# EAGLE board star (EAGLE 9.6.2)
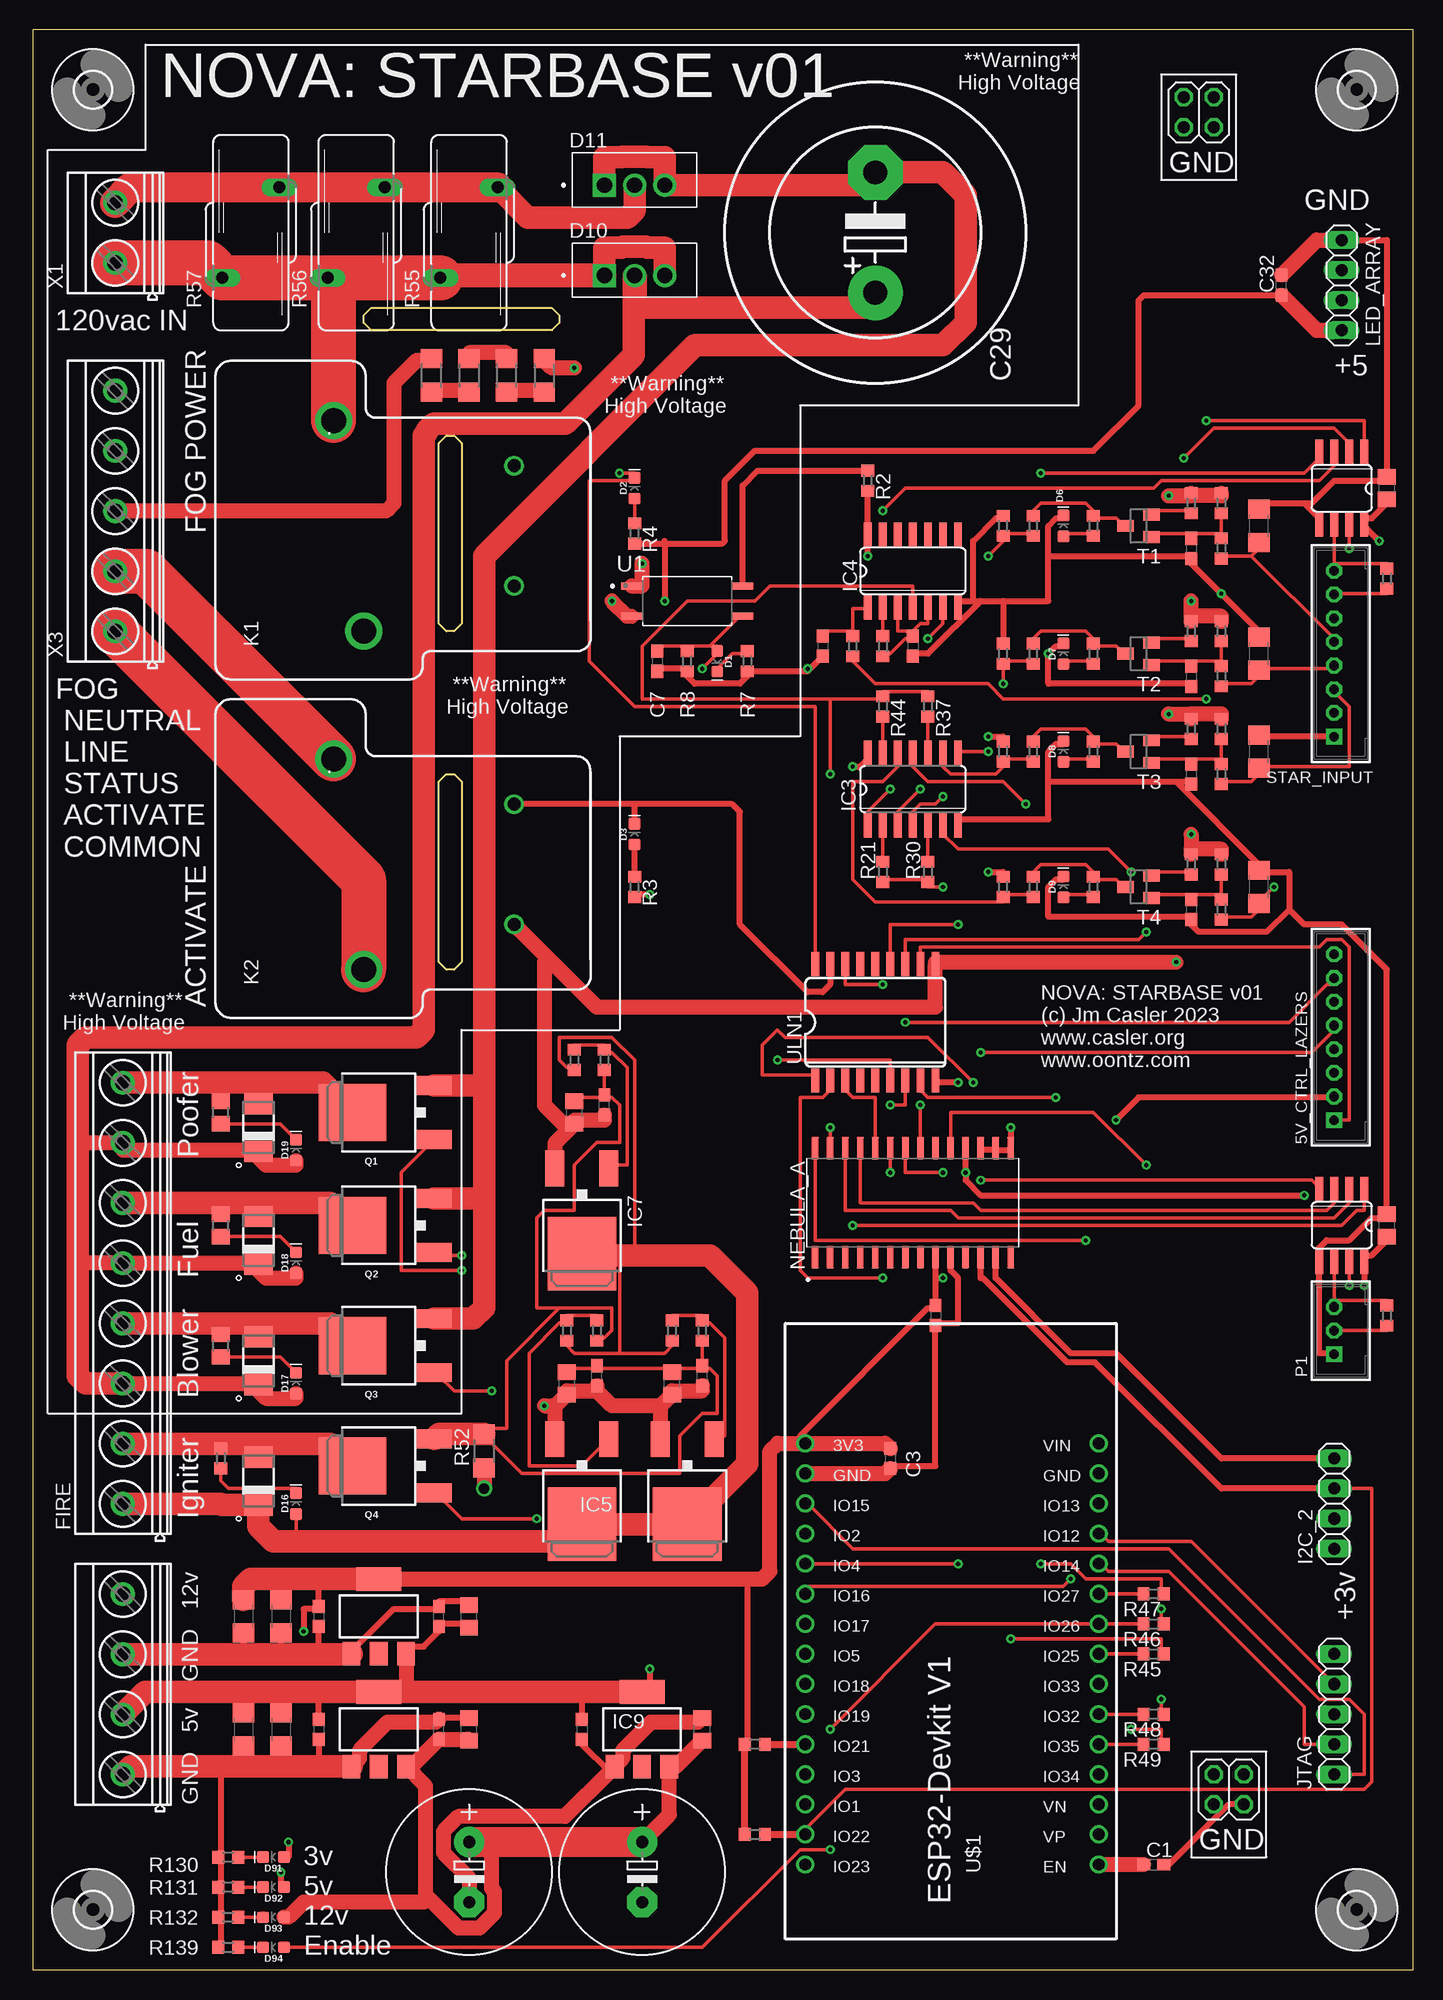
[diagram p2: board, top side]
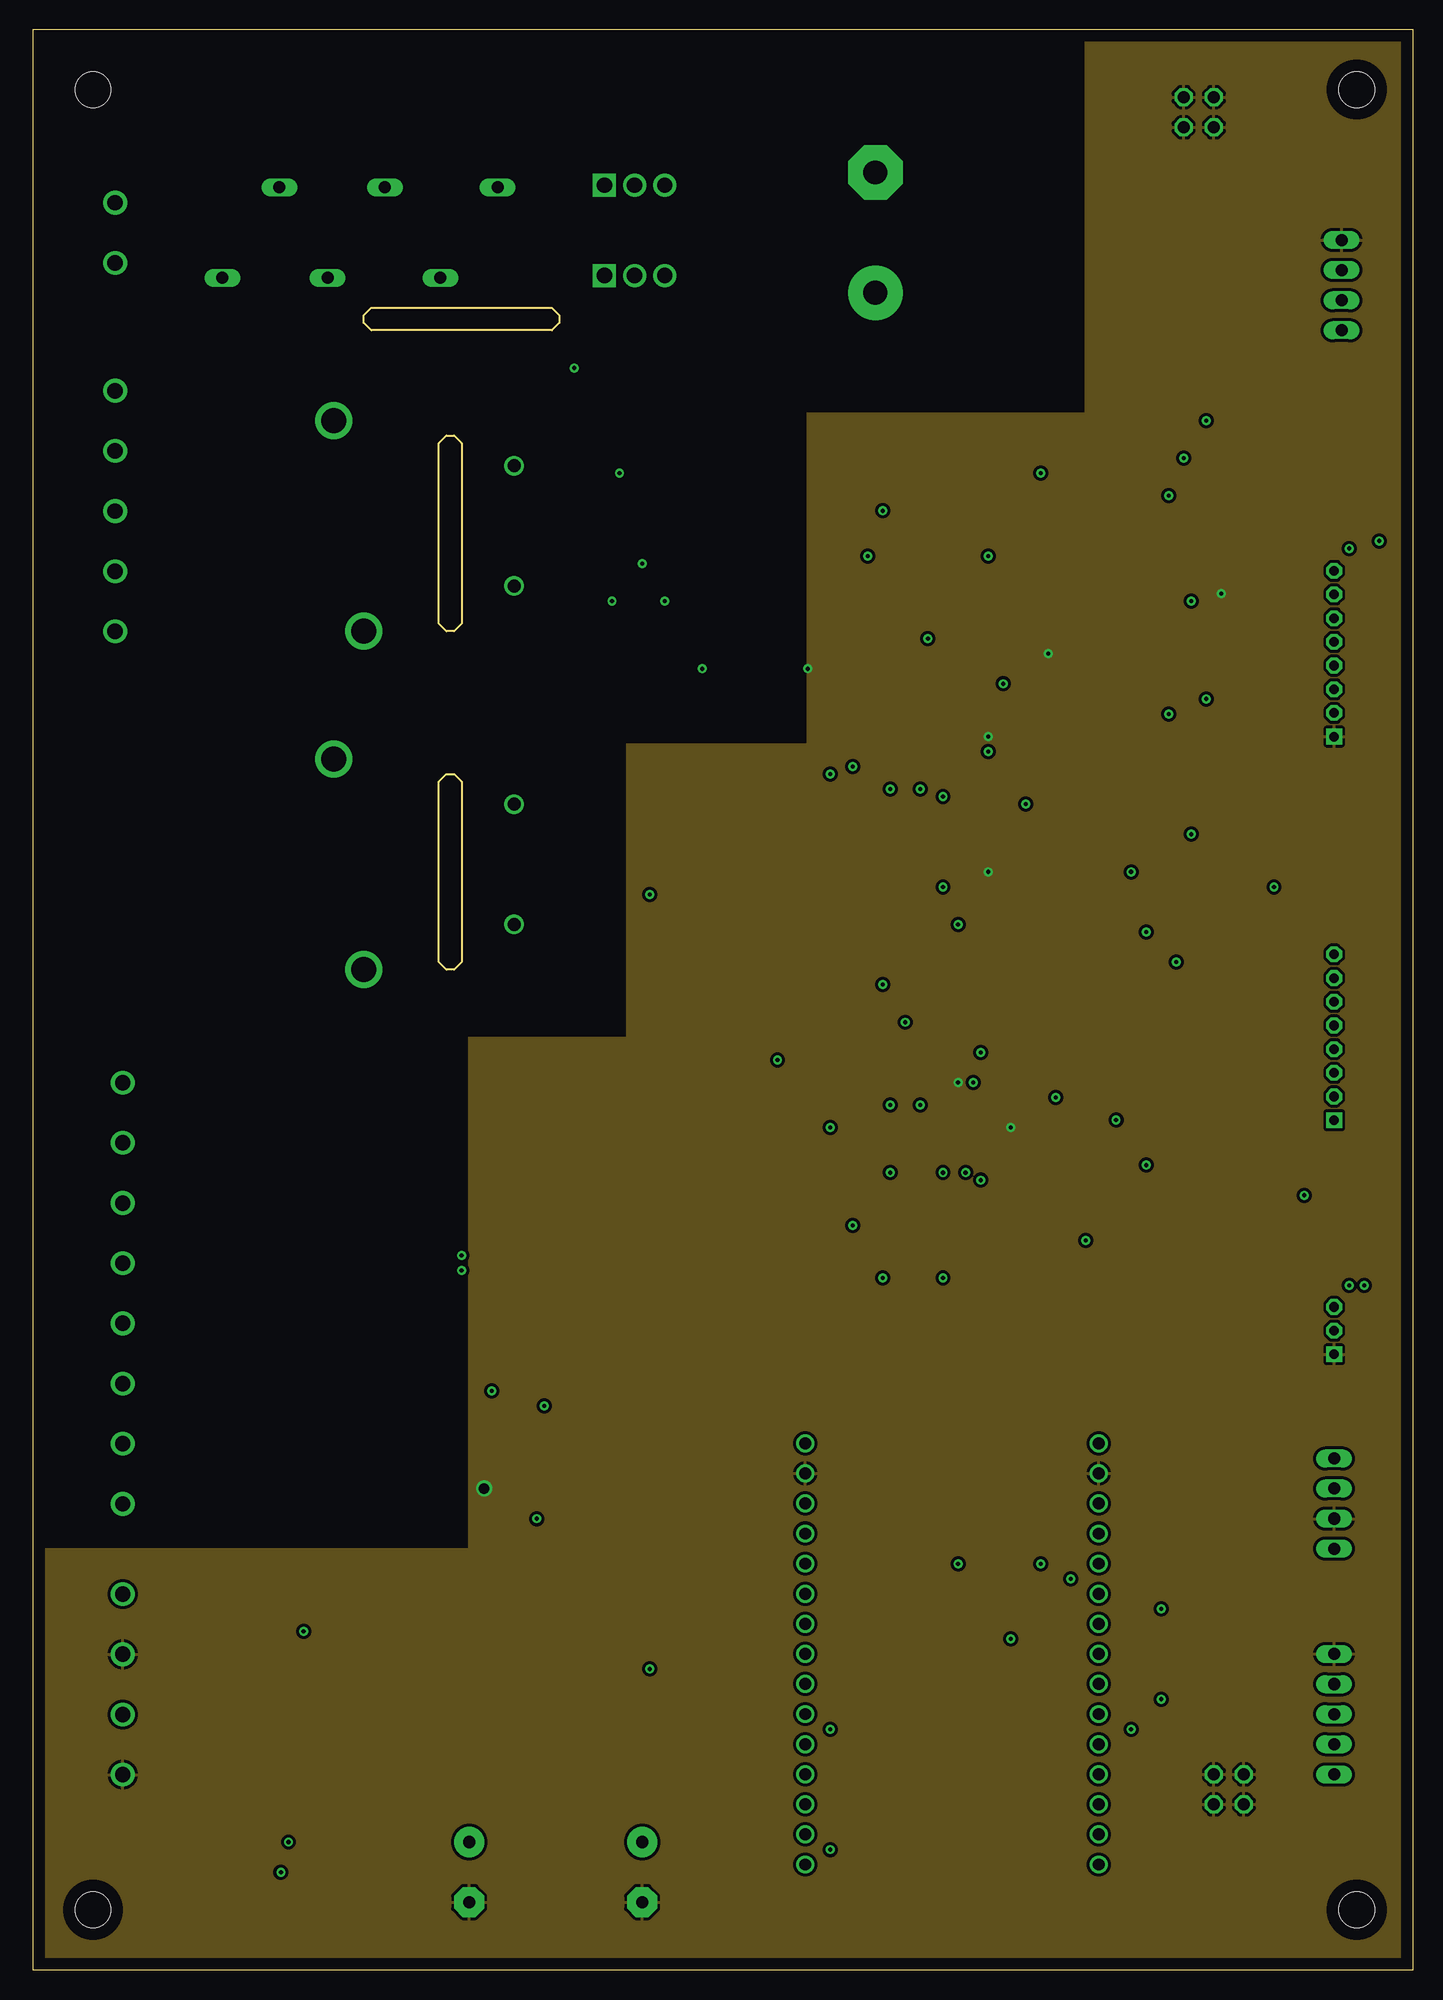
[diagram p3: board, inner layer $GND]
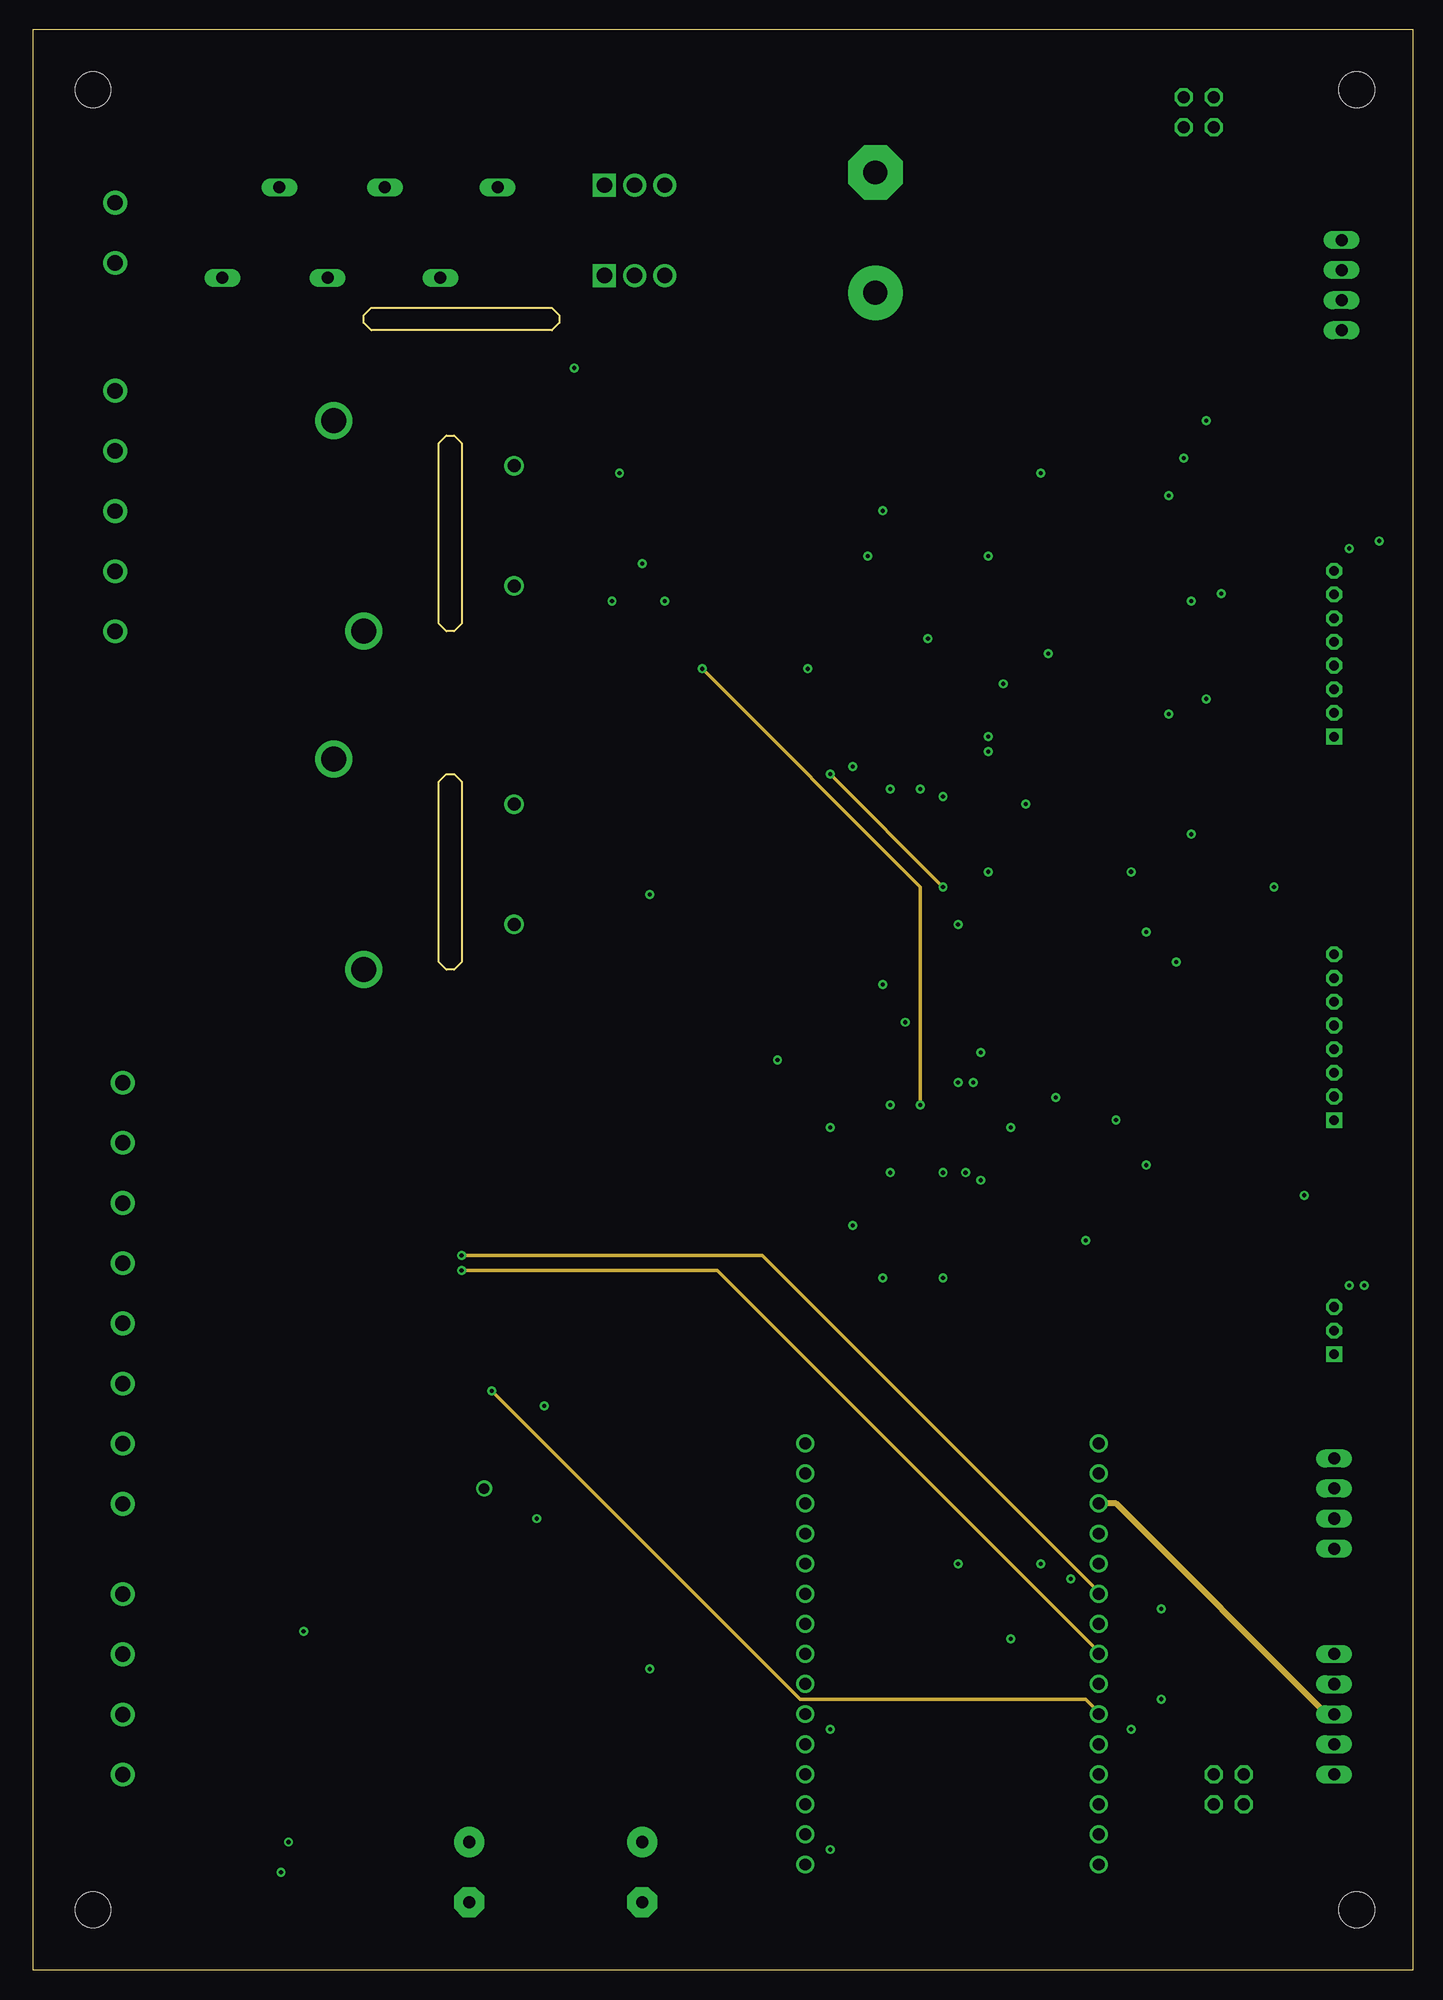
[diagram p4: board, inner layer SIGNAL3]
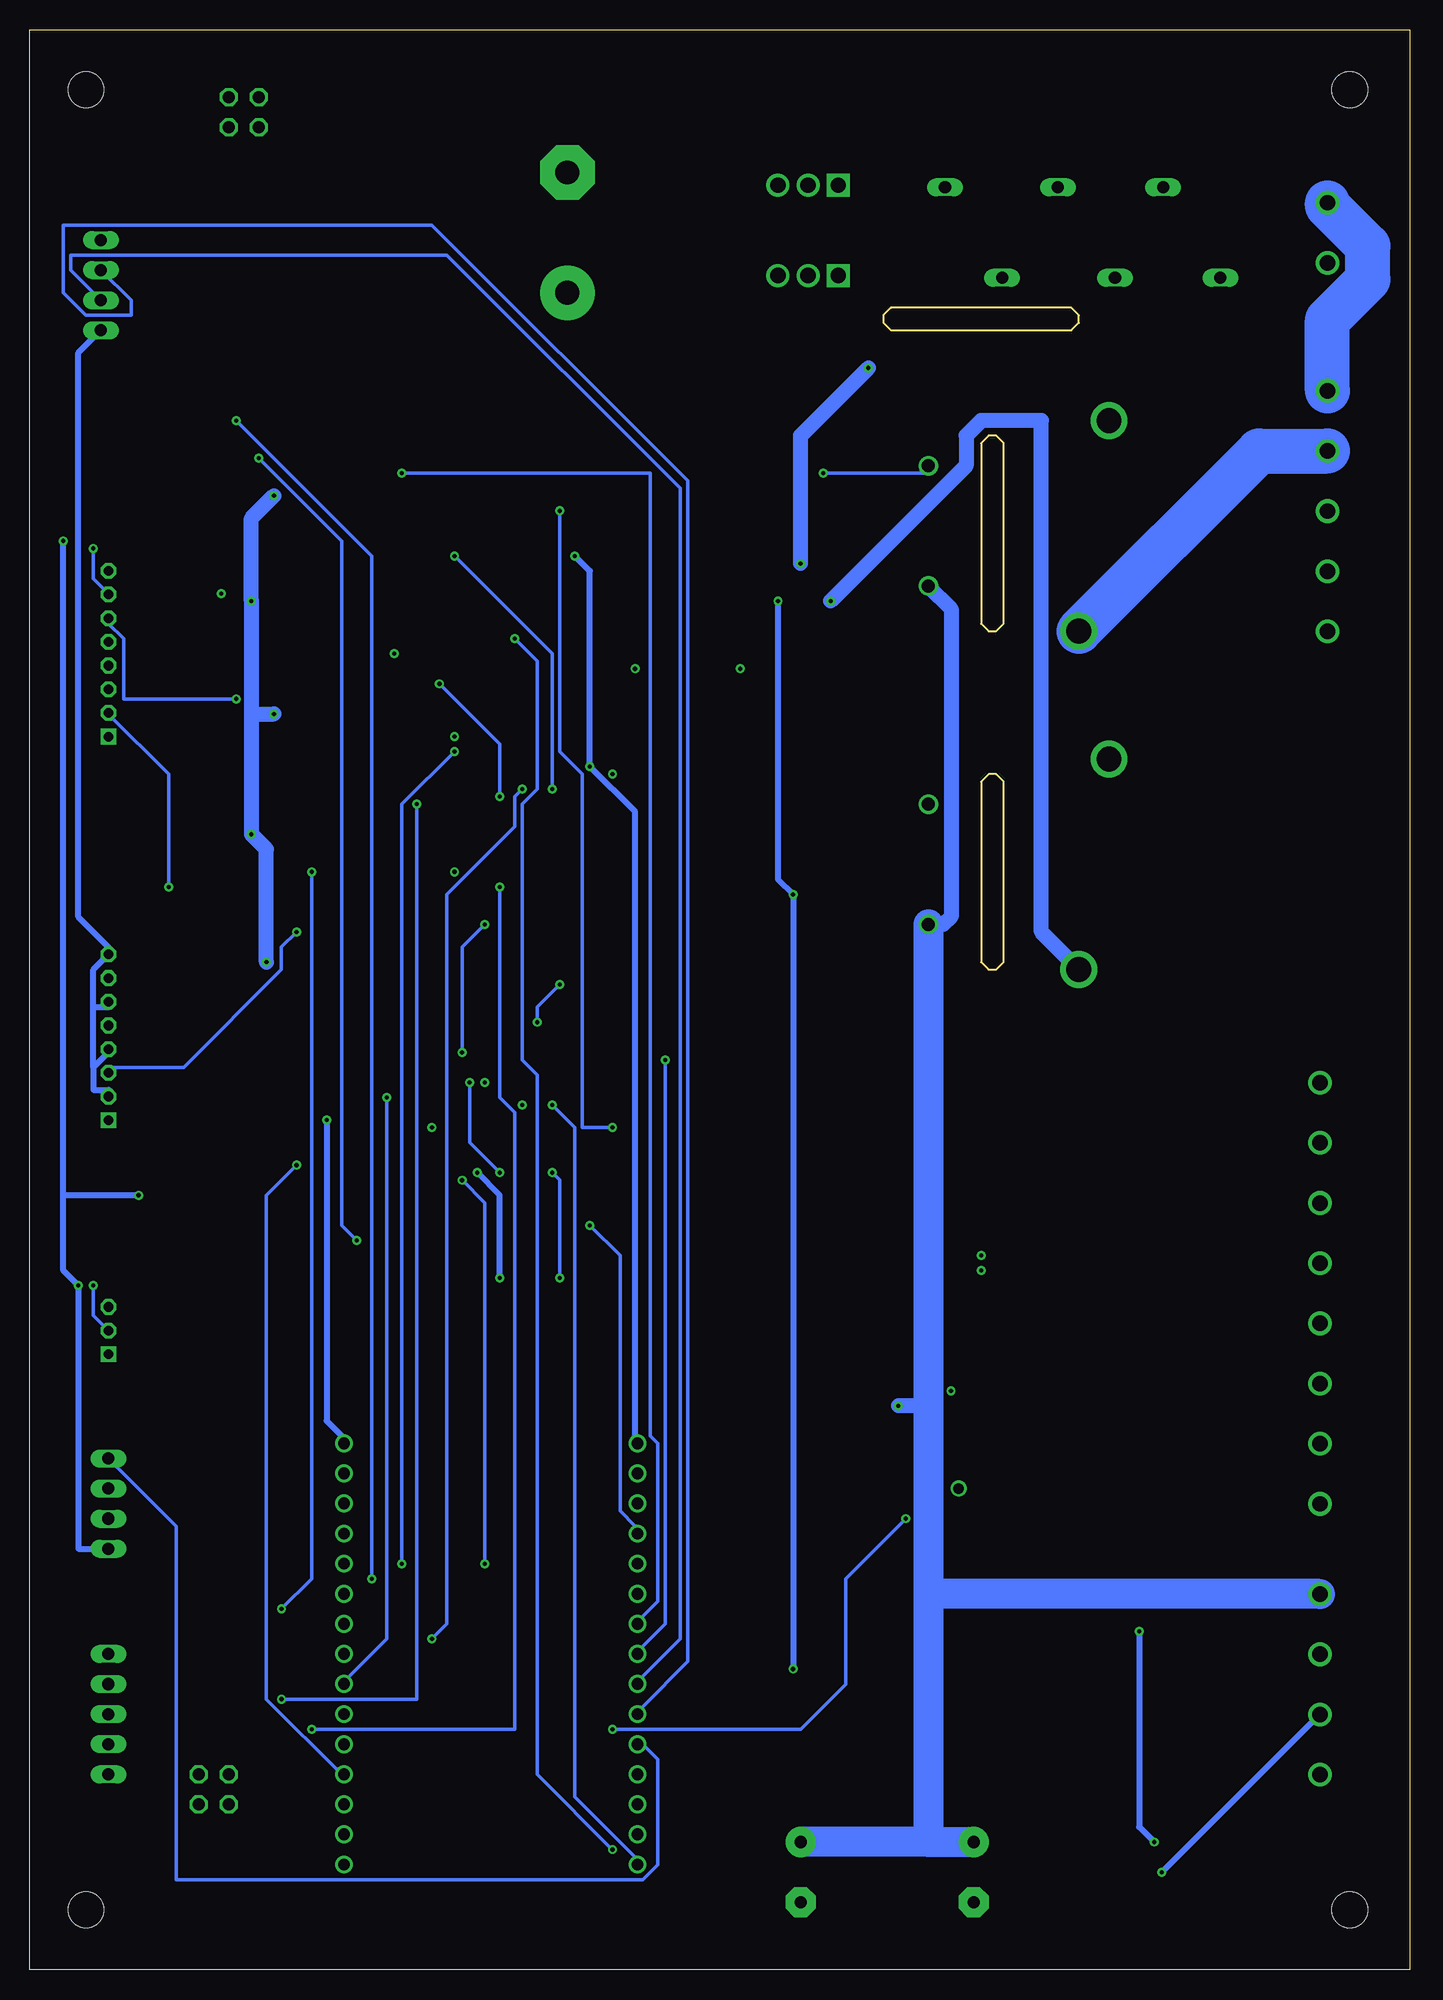
[diagram p5: board, bottom side, seen from below]

Size 116.51 x 163.82 mm. Coordinates in mm from the lower left corner, seen from the top.
Outline: 0,0 116.51,0 116.51,163.82 0,163.82 0,0
Copper layers (1+2*15+16): Top 0.035mm / dielectric 1.5mm / $GND 0.035mm / dielectric 0.15mm / SIGNAL3 0.035mm / dielectric 0.2mm / Bottom 0.035mm
Design rules "default *": minimum track width 6mil, minimum drill 0.35mm, track to track 6mil, track to pad 6mil, pad to pad 6mil, via to via 6mil, smd to smd 6mil, copper to edge 40mil, drill to drill 6mil, minimum pad ring 10mil, minimum via ring 8mil, stop-mask expansion 4mil, vias tented up to drill 20mil, thermal gap 10mil
Net classes: 0 default: width 0.305 mm, clearance 0.254 mm; 1 GND: width 0.508 mm, clearance 0.254 mm; 2 12V: width 1.27 mm, clearance 0.254 mm; 3 5V: width 0.508 mm, clearance 0.254 mm; 4 3V3: width 0.508 mm, clearance 0.254 mm; 5 12V_FUSED: width 0.635 mm, clearance 0.254 mm; 6 120VAC_PWR: width 1.27 mm, clearance 0.508 mm; 7 120VAC: width 1.27 mm, clearance 0.508 mm; 8 60V: width 1.27 mm, clearance 0.508 mm
tRestrict: area 34.3,113 to 36.2,129.5; area 27.9,138.4 to 44.5,140.3
bRestrict: area 34.3,113 to 36.2,129.5; area 34.3,84.5 to 36.2,101; area 27.9,138.4 to 44.5,140.3
Milling: 24 lines

## Footprints (pad centres in the part's own frame; a part is rotated, then mirrored left to right if it is on the bottom)
B8B-PH-K = drill 0.813 square: 1 -7,0 | drill 0.813 octagon: 2 -5,0; 3 -3,0; 4 -1,0; 5 1,0; 6 3,0; 7 5,0; 8 7,0
C0603 = smd 1.1 x 1: 1 -0.85,0; 2 0.85,0
C0805 = smd 1.3 x 1.5: 1 -0.95,0; 2 0.95,0
C1206 = smd 1.6 x 1.8: 1 -1.4,0; 2 1.4,0
E5-13 = drill 1.016 pad 2.54: + -2.54,0 | drill 1.016 pad 2.54 octagon: - 2.54,0
EB25D = drill 2.007 pad 4.597: + -5.08,0 | drill 2.007 pad 4.597 octagon: - 5.08,0
LED-0603 = smd 1 x 1: A -0.877,0; C 0.877,0
TO254P1050X476X2020-3 = drill 1.29 pad 1.94 square: 1 -2.54,-0.453 | drill 1.29 pad 1.94: 2 0,-0.453; 3 2.54,-0.453
DO-214AC = smd 1.8 x 2.4: A 2.025,0; C -2.025,0
MKDSN1,5/8-5,08 = drill 1.3 pad 2: 1 -17.801,0.025; 2 -12.721,0.025; 3 -7.641,0.025; 4 -2.561,0.025; 5 2.519,0.025; 6 7.599,0.025; 7 12.679,0.025; 8 17.759,0.025
3,0 = hole 3: 0,0
1X04 = drill 1.016 long: 1 -3.81,0; 2 -1.27,0; 3 1.27,0; 4 3.81,0
SO08 = smd 0.66 x 2.032: 1 -1.905,-3.073; 2 -0.635,-3.073; 3 0.635,-3.073; 4 1.905,-3.073; 5 1.905,3.073; 6 0.635,3.073; 7 -0.635,3.073; 8 -1.905,3.073
SOT223 = smd 1.5 x 2: 1 -2.3,-3.15; 2 0,-3.15; 3 2.3,-3.15 | smd 3.8 x 2: 4 0,3.15
SO14 = smd 0.66 x 2.032: 1 -3.81,-3.073; 2 -2.54,-3.073; 3 -1.27,-3.073; 4 0,-3.073; 5 1.27,-3.073; 6 2.54,-3.073; 7 3.81,-3.073; 8 3.81,3.073; 9 2.54,3.073; 10 1.27,3.073; 11 0,3.073; 12 -1.27,3.073; 13 -2.54,3.073; 14 -3.81,3.073
DPACK = smd 1.6 x 3: 1 -2.28,-4.8; 3 2.28,-4.8 | smd 5.8 x 6.2: 4 0,2.38
2X02 = drill 1.016 octagon: 1 -1.27,-1.27; 2 -1.27,1.27; 3 1.27,-1.27; 4 1.27,1.27
1X05 = drill 1.016 long: 1 -5.08,0; 2 -2.54,0; 3 0,0; 4 2.54,0; 5 5.08,0
JT1A-PCB = drill 1.1: 1 5.08,0; 2 -5.08,0 | drill 2.1: C -8.89,12.7; NO 8.89,15.24
SOIC127P1030X265-28N = smd 1.9 x 0.6: 1 -4.605,8.255; 2 -4.605,6.985; 3 -4.605,5.715; 4 -4.605,4.445; 5 -4.605,3.175; 6 -4.605,1.905; 7 -4.605,0.635; 8 -4.605,-0.635; 9 -4.605,-1.905; 10 -4.605,-3.175; 11 -4.605,-4.445; 12 -4.605,-5.715; 13 -4.605,-6.985; 14 -4.605,-8.255; 15 4.605,-8.255; 16 4.605,-6.985; 17 4.605,-5.715; 18 4.605,-4.445; 19 4.605,-3.175; 20 4.605,-1.905; 21 4.605,-0.635; 22 4.605,0.635; 23 4.605,1.905; 24 4.605,3.175; 25 4.605,4.445; 26 4.605,5.715; 27 4.605,6.985; 28 4.605,8.255
B3B-PH-K = drill 0.813 square: 1 -2,0 | drill 0.813 octagon: 2 0,0; 3 2,0
MKDSN1,5/4-5,08 = drill 1.3 pad 2: 1 -7.641,0.025; 2 -2.561,0.025; 3 2.519,0.025; 4 7.599,0.025
DPAK = smd 1.6 x 3: 1 -2.28,-5.31; 3 2.28,-5.31 | smd 4.826 x 5.715: 4 0,1.588
R0603 = smd 1 x 1.1: 1 -0.85,0; 2 0.85,0
R1206 = smd 1.6 x 1.803: 1 -1.422,0; 2 1.422,0
S14K420 = drill 1.016 long: 1 -2.413,-3.81; 2 2.413,3.81
R0805 = smd 1.3 x 1.5: 1 -0.95,0; 2 0.95,0
SOT23 = smd 1.4 x 1: 1 -1.1,0.95; 2 -1.1,-0.95; 3 1.1,0
SOP254P1015X230-4N = smd 1.84 x 0.64: 1 -4.685,1.27; 2 -4.685,-1.27; 3 4.685,-1.27; 4 4.685,1.27
ESP32-DEVKITV1 = drill 1 pad 1.422: 1 -22.87,-13.54; 2 -20.33,-13.54; 3 -17.79,-13.54; 4 -15.25,-13.54; 5 -12.71,-13.54; 6 -10.17,-13.54; 7 -7.63,-13.54; 8 -5.09,-13.54; 9 -2.55,-13.54; 10 -0.01,-13.54; 11 2.53,-13.54; 12 5.07,-13.54; 13 7.61,-13.54; 14 10.15,-13.54; 15 12.69,-13.54; 16 12.69,11.23; 17 10.15,11.23; 18 7.61,11.23; 19 5.07,11.23; 20 2.53,11.23; 21 -0.01,11.23; 22 -2.55,11.23; 23 -5.09,11.23; 24 -7.63,11.23; 25 -10.17,11.23; 26 -12.71,11.23; 27 -15.25,11.23; 28 -17.79,11.23; 29 -20.33,11.23; 30 -22.87,11.23
SO18L = smd 0.66 x 2.032: 1 -0.635,-4.902; 2 0.635,-4.902; 3 1.905,-4.902; 4 3.175,-4.902; 5 4.445,-4.902; 6 5.715,-4.902; 7 6.985,-4.902; 8 8.255,-4.902; 9 9.525,-4.902; 10 9.525,4.902; 11 8.255,4.902; 12 6.985,4.902; 13 5.715,4.902; 14 4.445,4.902; 15 3.175,4.902; 16 1.905,4.902; 17 0.635,4.902; 18 -0.635,4.902
MKDSN1,5/2-5,08 = drill 1.3 pad 2: 1 -2.561,0.025; 2 2.519,0.025
MKDSN1,5/5-5,08 = drill 1.3 pad 2: 1 -10.181,0.025; 2 -5.101,0.025; 3 -0.021,0.025; 4 5.059,0.025; 5 10.139,0.025

## Placement (x,y rotation side)
5V_CTRL_LAZERS  B8B-PH-K  [B8B-PH-K]  109.86,78.74 90 top
C1  10uf  [C0603]  94.61,8.89 0 top
C2  10uf  [C0603]  34.29,20.32 90 top
C3  10uf  [C0603]  72.39,43.18 270 top
C4  1uf  [C0805]  36.83,20.32 90 top
C5  10uf  [C0603]  24.13,20.32 270 top
C6  1uf  [C0805]  36.83,29.84 90 top
C7  C_1NF/50V_0603  [C0603]  52.7,110.49 270 top
C8  10uf  [C0603]  76.2,55.24 270 top
C9  C_100UF/6.3V_1206  [C1206]  20.95,20.32 270 top
C10  C_100UF/6.3V_1206  [C1206]  17.78,20.32 270 top
C11  C_100UF/6.3V_1206  [C1206]  20.95,29.84 270 top
C12  C_100UF/6.3V_1206  [C1206]  17.78,29.84 270 top
C13  C_1NF/2KV_1206  [C1206]  103.5,121.92 90 top
C14  1uf  [C0805]  114.3,125.09 90 top
C15  C_100PF/50V_0603  [C0603]  97.79,120.02 270 top
C16  C_1NF/50V_0603  [C0603]  66.67,111.76 270 top
C17  C_1NF/50V_0603  [C0603]  74.3,111.76 270 top
C18  C_1NF/2KV_1206  [C1206]  103.5,111.12 90 top
C19  C_100PF/50V_0603  [C0603]  97.79,109.22 270 top
C20  C_1NF/2KV_1206  [C1206]  103.5,102.87 90 top
C21  C_100PF/50V_0603  [C0603]  97.79,100.97 270 top
C22  C_1NF/2KV_1206  [C1206]  103.5,91.44 90 top
C23  C_100PF/50V_0603  [C0603]  97.79,89.53 270 top
C24  1uf  [C0805]  45.09,49.53 90 top
C25  10uf  [C0603]  47.62,50.16 90 top
C26  1uf  [C0805]  53.98,49.53 90 top
C27  10uf  [C0603]  56.52,50.16 90 top
C28  2200uf  [E5-13]  51.44,8.26 270 top
C29  [EB25D]  71.12,146.69 90 top
C30  1uf  [C0805]  45.72,72.39 90 top
C31  10uf  [C0603]  48.26,73.03 90 top
C32  C_1UF/50V_0603  [C0603]  105.41,142.24 90 top
C33  1uf  [C0805]  114.3,62.87 90 top
C34  1uf  [C0805]  56.52,20.32 90 top
C35  10uf  [C0603]  34.29,29.84 90 top
C36  10uf  [C0603]  24.13,29.84 270 top
C37  10uf  [C0603]  46.35,20.32 270 top
C89  2200uf  [E5-13]  36.83,8.26 270 top
D1  red  [LED-0603]  57.78,110.49 270 top
D2  blue  [LED-0603]  50.8,125.09 90 top
D3  blue  [LED-0603]  50.8,95.89 90 top
D6  green  [LED-0603]  87,121.92 90 top
D7  green  [LED-0603]  87,111.12 90 top
D8  green  [LED-0603]  87,102.87 90 top
D9  green  [LED-0603]  87,91.44 90 top
D10  MBR20200CT  [TO254P1050X476X2020-3]  50.8,143.51 0 top
D11  MBR20200CT  [TO254P1050X476X2020-3]  50.8,151.13 0 top
D12  D_SS210_MDD_SMA  [DO-214AC]  19.05,71.12 90 top
D13  D_SS210_MDD_SMA  [DO-214AC]  19.05,61.59 90 top
D14  D_SS210_MDD_SMA  [DO-214AC]  19.05,51.44 90 top
D15  D_SS210_MDD_SMA  [DO-214AC]  19.05,41.27 90 top
D16  blue  [LED-0603]  22.23,39.37 90 top
D17  blue  [LED-0603]  22.23,49.53 90 top
D18  blue  [LED-0603]  22.23,59.69 90 top
D19  blue  [LED-0603]  22.23,69.22 90 top
D91  red  [LED-0603]  20.32,9.53 180 top
D92  green  [LED-0603]  20.32,6.99 180 top
D93  blue  [LED-0603]  20.32,4.45 180 top
D94  yellow  [LED-0603]  20.32,1.91 180 top
FIRE  MKDSN1,5/8-5,08  [MKDSN1,5/8-5,08]  7.62,57.15 90 top
H1  MOUNT-HOLE3.0  [3,0]  111.76,5.08 0 top
H2  MOUNT-HOLE3.0  [3,0]  111.76,158.75 0 top
H3  MOUNT-HOLE3.0  [3,0]  5.08,158.75 0 top
H4  MOUNT-HOLE3.0  [3,0]  5.08,5.08 0 top
I2C_2  [1X04]  109.86,39.37 90 top
IC1  MAX481CSA  [SO08]  110.49,125.09 180 top
IC2  LD117AS12TR  [SOT223]  29.21,20.32 0 top
IC3  74HCT08D  [SO14]  74.3,99.69 0 top
IC4  7404D  [SO14]  74.3,118.11 0 top
IC5  LM317MABDT  [DPACK]  46.35,40.01 180 top
IC6  LM317MABDT  [DPACK]  55.24,40.01 180 top
IC7  LM317MABDT  [DPACK]  46.35,62.87 180 top
IC8  MAX481CSA  [SO08]  110.49,62.87 180 top
IC9  LD117AS12TR  [SOT223]  51.44,20.32 0 top
IC22  LD117AS12TR  [SOT223]  29.21,29.84 0 top
JP1  [2X02]  98.42,156.84 0 top
JP2  [2X02]  100.97,15.24 0 top
JTAG  [1X05]  109.86,21.59 270 top
K1  T90-12VDC-TL-A  [JT1A-PCB]  40.64,121.92 90 top
K2  T90-12VDC-TL-A  [JT1A-PCB]  40.64,93.34 90 top
LED_ARRAY  [1X04]  110.49,142.24 90 top
NEBULA_A  MCP23017-E/SO  [SOIC127P1030X265-28N]  74.3,64.77 90 top
P1  B3B-PH-K  [B3B-PH-K]  109.86,53.98 90 top
POWER_IN  MKDSN1,5/4-5,08  [MKDSN1,5/4-5,08]  7.62,24.13 90 top
Q1  35A/25V/8.5mΩ  [DPAK]  28.57,72.39 90 top
Q2  35A/25V/8.5mΩ  [DPAK]  28.57,62.87 90 top
Q3  35A/25V/8.5mΩ  [DPAK]  28.57,52.7 90 top
Q4  35A/25V/8.5mΩ  [DPAK]  28.57,42.55 90 top
R1  120  [R0603]  114.3,117.47 270 top
R2  R_150R_0603  [R0603]  70.48,125.73 270 top
R3  R_1.2K_0603  [R0603]  50.8,91.44 270 top
R4  R_1.2K_0603  [R0603]  50.8,121.28 270 top
R5  120  [R0603]  114.3,55.24 270 top
R7  1k  [R0603]  60.33,110.49 270 top
R8  1k  [R0603]  55.24,110.49 270 top
R9  R_7.5K_0603  [R0603]  100.33,120.02 90 top
R10  R_4.7K_1206  [R1206]  43.18,134.62 90 top
R11  R_4.7K_1206  [R1206]  40.01,134.62 270 top
R12  R_4.7K_1206  [R1206]  36.83,134.62 90 top
R13  R_4.7K_1206  [R1206]  33.66,134.62 270 top
R14  R_2K_0603  [R0603]  100.33,123.83 90 top
R15  R_10R_0603  [R0603]  97.79,123.83 90 top
R16  R_12K_0603  [R0603]  89.53,121.92 90 top
R17  R_2.7K_0603  [R0603]  84.45,121.92 90 top
R18  R_1K_0603  [R0603]  81.92,121.92 270 top
R19  R_5.1K_0603  [R0603]  69.22,111.76 90 top
R20  R_5.1K_0603  [R0603]  71.75,111.76 270 top
R21  R_2K_0603  [R0603]  71.75,92.71 90 top
R22  R_7.5K_0603  [R0603]  100.33,109.22 90 top
R23  R_2K_0603  [R0603]  100.33,113.03 90 top
R24  R_10R_0603  [R0603]  97.79,113.03 90 top
R25  R_12K_0603  [R0603]  89.53,111.12 90 top
R26  R_3K_0603  [R0603]  60.96,11.43 180 top
R27  R_3K_0603  [R0603]  60.96,19.05 180 top
R28  R_2.7K_0603  [R0603]  84.45,111.12 90 top
R29  R_1K_0603  [R0603]  81.92,111.12 270 top
R30  R_2K_0603  [R0603]  75.56,92.71 90 top
R31  R_7.5K_0603  [R0603]  100.33,100.97 90 top
R32  R_2K_0603  [R0603]  100.33,104.78 90 top
R33  R_10R_0603  [R0603]  97.79,104.78 90 top
R34  R_12K_0603  [R0603]  89.53,102.87 90 top
R35  R_2.7K_0603  [R0603]  84.45,102.87 90 top
R36  R_1K_0603  [R0603]  81.92,102.87 270 top
R37  R_2K_0603  [R0603]  75.56,106.68 270 top
R38  R_7.5K_0603  [R0603]  100.33,89.53 90 top
R39  R_2K_0603  [R0603]  100.33,93.34 90 top
R40  R_10R_0603  [R0603]  97.79,93.34 90 top
R41  R_12K_0603  [R0603]  89.53,91.44 90 top
R42  R_2.7K_0603  [R0603]  84.45,91.44 90 top
R43  R_1K_0603  [R0603]  81.92,91.44 270 top
R44  R_2K_0603  [R0603]  71.75,106.68 270 top
R45  R_6.2K_0603  [R0603]  94.61,26.67 180 top
R46  R_6.2K_0603  [R0603]  94.61,29.21 180 top
R47  R_6.2K_0603  [R0603]  94.61,31.75 180 top
R48  R_6.2K_0603  [R0603]  94.61,21.59 180 top
R49  R_0R_0603  [R0603]  94.61,19.05 180 top
R50  R_240R_0603  [R0603]  45.09,53.98 270 top
R51  R_750R_0603  [R0603]  47.62,53.98 90 top
R52  R_0R_1206  [R1206]  38.1,43.81 90 top
R53  R_240R_0603  [R0603]  53.98,53.98 270 top
R54  R_750R_0603  [R0603]  56.52,53.98 90 top
R55  S14K420  [S14K420]  36.83,146.69 0 top
R56  S14K420  [S14K420]  27.3,146.69 0 top
R57  S14K420  [S14K420]  18.41,146.69 0 top
R58  R_240R_0603  [R0603]  45.72,76.83 270 top
R59  R_750R_0603  [R0603]  48.26,76.83 90 top
R60  R_56K_0805  [R0805]  15.88,72.39 90 top
R61  R_56K_0805  [R0805]  15.88,62.87 90 top
R62  R_56K_0805  [R0805]  15.88,52.7 90 top
R63  R_2.2K_0603  [R0603]  15.88,43.18 90 top
R130  1k  [R0603]  16.51,9.53 180 top
R131  2.2k  [R0603]  16.51,6.99 180 top
R132  12k  [R0603]  16.51,4.45 180 top
R139  1k  [R0603]  16.51,1.91 180 top
STAR_INPUT  B8B-PH-K  [B8B-PH-K]  109.86,111.12 90 top
T1  T_PNP_MMBT5401_CHANGJ_SOT23-BEC  [SOT23]  93.34,121.92 180 top
T2  T_PNP_MMBT5401_CHANGJ_SOT23-BEC  [SOT23]  93.34,111.12 180 top
T3  T_PNP_MMBT5401_CHANGJ_SOT23-BEC  [SOT23]  93.34,102.87 180 top
T4  T_PNP_MMBT5401_CHANGJ_SOT23-BEC  [SOT23]  93.34,91.44 180 top
U1  TCLT1600  [SOP254P1015X230-4N]  55.24,115.57 0 top
U$1  ESP32DEVKITV1  [ESP32-DEVKITV1]  78.74,21.59 270 top
ULN1  [SO18L]  66.67,80.01 0 top
X1  MKDSN1,5/2-5,08  [MKDSN1,5/2-5,08]  6.99,146.69 90 top
X3  MKDSN1,5/5-5,08  [MKDSN1,5/5-5,08]  6.99,123.19 90 top

## Tracks (layer width: path | path; a pad name or v marks a point on that pad's centre or on a via)
2  (via drill 0.35)
  Top 0.305: IC8.1 112.39,64.14 111.76,64.14 110.49,62.87 v69.22,62.87
  Bottom 0.305: v69.22,62.87 66.67,60.33 66.67,38.73 65.41,37.47 U$1.4
4  (via drill 0.35)
  Top 0.305: v80.01,66.67 107.95,66.67 108.58,66.04 IC8.4 | v78.11,34.29 65.41,34.29 U$1.5
  Bottom 0.305: v80.01,66.67 78.11,64.77 v78.11,34.29
5  (via drill 0.35)
  Top 0.305: ULN1.6 72.39,76.83 v62.87,76.83
  Bottom 0.305: v62.87,76.83 62.87,29.21 64.77,27.3 U$1.8
12
  Top 0.305: JTAG.2 97.79,36.2 90.81,36.2 90.17,36.83 U$1.27
13
  SIGNAL3 0.508: JTAG.3 109.22,21.59 91.44,39.37 90.17,39.37 U$1.28
14
  Top 0.305: JTAG.4 107.31,19.05 107.31,22.23 95.89,33.66 90.81,33.66 90.17,34.29 U$1.26
15
  Top 0.305: JTAG.5 112.39,16.51 112.39,21.59 111.12,22.86 108.58,22.86 95.89,35.56 69.22,35.56 65.41,39.37 U$1.3
16  (via drill 0.35)
  Top 0.305: IC1.1 112.39,130.81 v99.06,130.81 | v87.63,33.02 87,32.38 65.41,32.38 U$1.6
  Bottom 0.305: v99.06,130.81 87.63,119.38 v87.63,33.02
17  (via drill 0.35)
  Top 0.305: v85.09,126.36 107.31,126.36 108.58,127.64 IC1.4
  Bottom 0.305: v85.09,126.36 64.14,126.36 64.14,45.09 63.5,44.45 63.5,31.11 64.77,29.84 U$1.7
18
  Bottom 0.305: LED_ARRAY.2 113.03,143.51 113.03,144.78 81.28,144.78 61.59,125.09 61.59,27.94 64.77,24.77 U$1.9
19
  Bottom 0.305: LED_ARRAY.3 107.95,140.97 107.95,139.7 111.76,139.7 113.67,141.6 113.67,147.32 82.55,147.32 60.96,125.73 60.96,26.04 64.77,22.23 U$1.10
21/SDA
  Top 0.508: I2C_2.4 100.33,43.18 91.44,52.07 87.63,52.07 81.28,58.42 NEBULA_A.13
  Top 0.61: R27.1 U$1.11
  Bottom 0.305: I2C_2.4 104.14,37.47 104.14,7.62 64.77,7.62 63.5,8.89 63.5,17.78 64.77,19.05 U$1.11
22/SCL
  Top 0.305: I2C_2.3 113.03,40.64 113.03,15.88 112.39,15.24 68.58,15.24 65.41,12.06 U$1.14
  Top 0.508: I2C_2.3 100.33,40.64 89.66,51.31 87.31,51.31 80.2,58.42 80.01,58.42 NEBULA_A.12
  Top 0.61: R26.1 U$1.14
23  (via drill 0.35)
  Top 0.305: ULN1.7 73.66,73.03 v72.39,73.03
  Bottom 0.305: v72.39,73.03 70.48,71.12 70.48,14.61 65.41,9.53 U$1.15
25_POOFER  (via drill 0.35)
  Top 0.305: R45.2 90.17,26.67 U$1.23 | v36.2,59.05 31.11,59.05 31.11,67.31 33.66,69.85 Q1.1
  SIGNAL3 0.305: v36.2,59.05 57.78,59.05 89.53,27.3 U$1.23
26_BOOM_IGNITER  (via drill 0.35)
  Top 0.305: R46.2 90.17,29.21 U$1.24 89.53,29.21 76.2,29.21 v67.31,20.32 | v42.55,38.1 36.2,38.1 34.29,40.01 Q4.1
  Bottom 0.305: v42.55,38.1 47.62,33.02 47.62,24.13 51.44,20.32 v67.31,20.32
27_BOOM_FUEL  (via drill 0.35)
  Top 0.305: R47.2 90.17,31.75 U$1.25 | v36.2,60.33 34.29,60.33 Q2.1
  SIGNAL3 0.305: v36.2,60.33 61.59,60.33 89.53,32.38 U$1.25
32_BOOM_BLOWER  (via drill 0.35)
  Top 0.305: R48.2 90.17,21.59 U$1.21 | v38.73,48.9 35.56,48.9 34.29,50.16 Q3.1
  SIGNAL3 0.305: v38.73,48.9 64.77,22.86 88.9,22.86 89.53,22.23 U$1.21
33  (via drill 0.35)
  Top 0.305: ULN1.8 74.93,74.3 75.56,73.66 v86.36,73.66
  Bottom 0.305: v86.36,73.66 86.36,27.94 89.53,24.77 U$1.22
34  (via drill 0.35)
  Top 0.305: NEBULA_A.19 77.47,72.39 89.53,72.39 v93.98,67.94
  Bottom 0.305: v93.98,67.94 96.52,65.41 96.52,22.86 90.17,16.51 U$1.19
35
  Top 0.305: R49.2 90.17,19.05 U$1.20
60VDC
  Top 1.27: D19.A 22.23,67.94 19.68,67.94 19.05,68.58 D12.C 19.05,69.22 7.62,69.22 FIRE.7 6.99,69.85 3.81,69.85 | D17.A 22.23,48.26 19.68,48.26 19.05,48.9 D14.C 19.05,49.53 8.26,49.53 FIRE.3 | D18.A 22.23,58.42 19.68,58.42 19.05,59.05 D13.C 19.05,59.69 7.62,59.69 FIRE.5 6.99,59.69 3.81,59.69
  Top 1.905: C29.+ 71.12,140.97 70.48,140.34 51.35,140.34 50.91,140.78 50.91,142.95 D10.2 50.74,142.99 50.74,136.35 44.95,130.57 33.86,130.57 33.26,129.97 33.26,129.78 33.02,129.54 33.02,79.38 32.38,78.74 4.45,78.74 3.81,78.11 3.81,69.85 3.81,59.69 3.81,50.16 4.47,49.51 FIRE.3
120_LINE
  Top 1.27: 36.2,143.06 36.2,142.88 R55.1
  Top 1.905: D10.1 48.26,145.41 49.72,145.41 49.79,145.49 51.81,145.49 51.88,145.41 53.34,145.41 D10.3
  Top 2.032: D10.1 36.2,143.06 34.6,143.06
  Top 3.81: X1.1 14.75,144.12 R57.1 R56.1 | R56.1 R55.1 | K1.NO 25.4,142.37 R56.1
120_NEUTRAL
  Top 1.905: D11.2 50.8,148.59 50.16,147.96 41.78,147.96 R55.2
  Top 2.54: X1.2 8.25,150.5 R57.2 R56.2 R55.2
  Bottom 3.81: X3.5 6.96,139.3 3.55,142.71 3.55,145.54 6.96,148.95 X1.2
+3V3  (via drill 0.35)
  Top 0.508: C14.1 114.3,123.83 113.03,122.56 112.39,122.56 IC1.8 112.39,121.92 v113.67,120.65 | C33.1 114.3,61.59 113.03,60.33 112.39,60.33 IC8.8 v112.39,57.78 | NEBULA_A.9 76.2,58.42 | 76.2,58.42 C8.1 76.2,55.88 75.56,55.88 64.77,45.09 U$1.1 | NEBULA_A.18 v78.74,67.31 78.74,66.67 80.01,65.41 v107.31,65.41 | 76.2,58.42 v76.83,58.42 | R2.2 IC4.14 v70.48,119.38 | 20.95,32.99 C11.1 | v21.59,10.79 21.59,9.53 D91.A | v22.86,28.57 22.86,30.48 24.13,30.48 C36.1 24.13,32.99 | v69.22,101.6 69.85,101.6 70.48,102.23 IC3.14 | 60.33,32.99 60.33,19.05 R27.2
  Top 0.61: R26.2 R27.2
  Top 1.27: C3.1 71.96,44.46 U$1.1 62.88,44.46 62.23,43.81 62.23,33.66 61.57,32.99 60.33,32.99 IC22.4
  Top 1.905: IC22.4 24.13,32.99 20.95,32.99 18.39,32.99 17.78,32.38 C12.1
  Bottom 0.508: I2C_2.1 112.39,35.56 v112.39,57.78 113.67,59.05 113.67,65.41 | 113.67,65.41 v113.67,120.65 | v78.74,67.31 76.83,65.41 v76.83,58.42 | v21.59,10.79 22.86,12.06 v22.86,28.57 | U$1.1 65.41,45.09 65.41,97.79 v69.22,101.6 69.22,118.11 v70.48,119.38 | v107.31,65.41 113.67,65.41
+5V  (via drill 0.35)
  Top 0.508: R4.2 53.34,120.44 | 53.34,120.44 58.2,120.44 58.42,120.65 58.42,125.73 60.96,128.27 89.53,128.27 93.34,132.08 93.34,140.97 93.77,141.39 C32.1 | C5.1 24.13,23.47 | C6.1 36.83,29.21 34.29,29.21 C35.1 34.29,28.57 33.02,27.3 31.75,27.3 IC22.3 | v20.95,8.26 20.95,6.99 D92.A | 46.35,23.47 C37.1 | 29.21,23.5 IC2.4 | v52.07,90.81 50.8,90.81 R3.2 | 53.34,120.44 v53.34,115.57 | 53.34,120.65 53.34,120.44 | v91.44,71.75 93.34,73.66 109.86,73.66 5V_CTRL_LAZERS.2 | v52.07,25.4 52.07,24.13 IC9.4
  Top 1.27: IC22.3 31.51,23.86 31.11,23.47 | C10.1 17.78,23.47 | C9.1 20.95,23.47 | C32.1 108.37,138.43 LED_ARRAY.1
  Top 1.905: IC9.4 46.35,23.47 31.11,23.47 IC2.4 24.13,23.47 20.95,23.47 17.78,23.47 9.5,23.47 POWER_IN.2
  Bottom 0.508: v20.95,8.26 7.62,21.59 POWER_IN.2 | v53.34,115.57 53.34,92.08 v52.07,90.81 v52.07,25.4 | 111.12,76.2 111.12,74.3 109.86,74.3 5V_CTRL_LAZERS.2 | 111.12,76.2 109.86,77.47 5V_CTRL_LAZERS.4 | 111.12,81.28 109.86,81.28 5V_CTRL_LAZERS.6 | 111.12,76.2 111.12,81.28 | 111.12,81.28 111.12,84.45 109.86,85.72 5V_CTRL_LAZERS.8 109.86,86.36 112.39,88.9 112.39,136.53 LED_ARRAY.1 | v91.44,71.75 91.44,46.35 90.17,45.09 U$1.30
+6V
  Top 0.305: 49.53,52.07 53.34,52.07 53.98,52.7 R53.2 | 49.53,52.07 45.72,52.07 45.09,52.7 R50.2 | 22.23,36.2 D16.A | 50.8,60.33 50.8,76.83 48.9,78.74 44.45,78.74 44.45,76.83 45.09,76.2 45.72,76.2 R58.2 | 49.53,60.33 49.53,52.07 | IC7.4 46.35,60.96 46.99,60.33
  Top 1.905: 46.99,60.33 49.53,60.33 50.8,60.33 57.15,60.33 60.33,57.15 60.33,42.7 IC6.4 IC5.4 44.92,36.2 22.23,36.2 20.32,36.2 19.05,37.47 D15.C 19.02,39.28 15.95,39.28 15.88,39.35 FIRE.1
+12V  (via drill 0.35)
  Top 1.27: 33.4,6.09 33.15,6.34 33.15,15.53 IC2.3 31.99,17.17 C2.1 36.73,19.47 C4.1 | 33.4,6.09 35.94,3.56 37.72,3.56 38.99,4.82 38.99,6.61 38.73,6.86 38.73,10.79 | C28.+ 53.73,13.1 IC9.3 54.31,17.17 C34.1 | 52.97,47.57 C26.1 53.98,48.9 56.52,48.9 C27.1 | 52.97,47.57 IC6.3 | 44.08,47.57 C24.1 45.09,48.9 47.62,48.9 | 44.08,47.57 IC5.3 | C30.1 44.08,69.8 IC7.3 | 97.79,106.05 100.33,106.05 R32.2 | 97.79,94.61 100.33,94.61 R39.2 | 97.79,124.46 100.33,124.46 R14.2 | 97.79,114.3 100.33,114.3 R23.2 | v95.89,124.46 97.79,124.46 | 97.79,114.3 v97.79,115.57 | 97.79,124.46 R15.2 | 97.79,114.3 R24.2 | v97.79,95.89 97.79,94.61 | 97.79,94.61 R40.2 | v95.89,106.05 97.79,106.05 | 97.79,106.05 R33.2 | 47.62,48.9 48.9,47.62 52.7,47.62 52.97,47.57 | 47.62,48.9 C25.1 | C31.1 48.26,71.75 45.72,71.75 C30.1 | D93.A 21.59,4.45 22.86,5.71 33.02,5.71 33.4,6.09 | K2.2 43.5,85.41 | 43.5,85.41 47.62,81.28 76.2,81.28 ULN1.10 76.2,85.09 v96.52,85.09 | C30.1 45.09,71.12 43.18,73.03 43.18,85.09 43.5,85.41 | v43.18,47.62 43.81,47.62 44.08,47.57
  Top 2.54: C89.+ 38.73,10.79 C28.+
  Bottom 1.27: K1.2 38.73,114.94 38.73,88.9 39.37,88.27 K2.2 | v95.89,124.46 97.79,122.56 v97.79,115.57 97.79,106.05 | 97.79,106.05 v97.79,95.89 96.52,94.61 v96.52,85.09 | 97.79,106.05 v95.89,106.05 | 40.64,47.62 v43.18,47.62 | 40.01,31.75 40.64,31.75
  Bottom 2.54: K2.2 40.64,47.62 40.64,31.75 40.64,10.79 | 40.64,10.79 C28.+ | 40.64,10.79 C89.+ | POWER_IN.4 39.98,31.73 40.01,31.75
A0  (via drill 0.35)
  Top 0.305: 55.24,111.76 57.15,111.76 | 57.15,111.76 57.78,111.76 D1.A 57.78,111.12 v56.52,109.86 | 55.24,111.76 52.7,111.76 C7.1 | 55.24,111.76 R8.1 | 57.15,111.76 59.69,114.3 U1.3 | v74.93,73.03 NEBULA_A.21
  SIGNAL3 0.305: v74.93,73.03 74.93,91.44 v56.52,109.86
A1  (via drill 0.35)
  Top 0.305: NEBULA_A.22 73.66,67.31 v76.83,67.31 | v79.38,74.93 75.56,78.74 63.5,78.74 62.87,79.38 61.59,78.11 61.59,75.56 66.04,75.56 ULN1.1
  Bottom 0.305: v76.83,67.31 79.38,69.85 v79.38,74.93
A2  (via drill 0.35)
  Top 0.305: v72.39,67.31 NEBULA_A.23 | v71.75,58.42 65.41,58.42 64.77,59.05 64.77,73.66 66.67,73.66 67.31,74.3 ULN1.2
  Bottom 0.305: v72.39,67.31 71.75,66.67 v71.75,58.42
A3
  Top 0.305: NEBULA_A.24 71.12,73.66 69.22,73.66 68.58,74.3 ULN1.3
A4
  Top 0.305: NEBULA_A.25 69.85,64.77 79.38,64.77 80.01,64.14 109.22,64.14 109.86,64.77 IC8.3
A5
  Top 0.305: NEBULA_A.26 68.58,64.14 77.47,64.14 78.11,63.5 109.86,63.5 111.12,64.77 IC8.2
A6  (via drill 0.35)
  Top 0.305: v67.31,71.12 NEBULA_A.27 | v71.75,123.19 73.66,125.09 94.61,125.09 95.25,125.73 108.58,125.73 109.86,127 IC1.3
  Bottom 0.305: v67.31,71.12 69.85,71.12 69.85,100.97 71.75,102.87 v71.75,123.19
A7  (via drill 0.35)
  Top 0.305: NEBULA_A.28 66.04,61.59 v88.9,61.59 | v97.16,127.64 99.69,130.18 109.86,130.18 111.12,128.91 IC1.2
  Bottom 0.305: v88.9,61.59 90.17,62.87 90.17,120.65 v97.16,127.64
BOOMER_BLOWER  (via drill 0.35)
  Top 0.305: R38.1 100.33,88.9 102.87,88.9 103.5,89.53 C22.1 103.5,90.17 v104.78,91.44
  Bottom 0.305: v104.78,91.44 104.78,100.97 109.86,106.05 STAR_INPUT.2
BOOMER_FUEL
  Top 0.305: R31.1 100.33,100.33 102.87,100.33 103.5,100.97 C20.1 103.5,101.6 111.12,101.6 111.12,106.68 109.86,107.95 STAR_INPUT.3
BOOMER_IGNITER
  Top 0.305: R22.1 100.33,108.58 102.87,108.58 103.5,109.22 C18.1 103.5,109.86 109.86,109.86 STAR_INPUT.4
EN_STATUS  (via drill 0.35)
  Top 0.305: D94.A 56.52,1.91 64.77,10.16 v67.31,10.16 | v75.56,112.39 76.83,113.67 IC4.6
  Bottom 0.305: v67.31,10.16 73.66,16.51 73.66,75.56 74.93,76.83 74.93,98.42 73.66,99.69 73.66,110.49 v75.56,112.39
EXP_ULN0  (via drill 0.35)
  Top 0.305: v49.53,126.36 50.8,126.36 D2.C 50.8,125.73 46.99,125.73 46.99,110.49 50.8,106.68 66.04,106.68 ULN1.18
  Bottom 0.305: v49.53,126.36 40.64,126.36 K1.1
EXP_ULN1
  Top 0.508: ULN1.17 67.31,83.19 66.67,82.55 65.41,82.55 59.69,88.27 59.69,97.79 59.05,98.42 50.8,98.42 | 50.8,98.42 K2.1 | D3.C 50.8,98.42
EXP_ULN2  (via drill 0.35)
  Top 0.305: ULN1.16 68.58,83.19 v71.75,83.19 | v73.66,80.01 106.05,80.01 109.22,83.19 109.86,83.19 5V_CTRL_LAZERS.7
  Bottom 0.305: v71.75,83.19 73.66,81.28 v73.66,80.01
EXP_ULN5  (via drill 0.35)
  Top 0.305: ULN1.13 72.39,88.27 v78.11,88.27 | v80.01,77.47 107.95,77.47 109.86,79.38 5V_CTRL_LAZERS.5
  Bottom 0.305: v78.11,88.27 80.01,86.36 v80.01,77.47
EXP_ULN6  (via drill 0.35)
  Top 0.305: ULN1.12 73.66,87 93.34,87 v93.98,87.63
  Bottom 0.305: v93.98,87.63 95.25,86.36 95.25,84.45 103.5,76.2 109.86,76.2 5V_CTRL_LAZERS.3
EXP_ULN7
  Top 0.305: ULN1.11 74.93,86.36 108.58,86.36 109.22,87 110.49,87 111.12,86.36 111.12,71.75 109.86,71.75 5V_CTRL_LAZERS.1
GND  (via drill 0.35, 0.9)
  Top 0.508: 65.41,109.64 R7.2 60.33,109.22 59.69,108.58 55.88,108.58 55.24,109.22 R8.2 55.24,109.86 52.7,109.86 C7.2 | 65.41,109.64 C16.2 | C5.2 24.13,17.17 | C4.2 34.39,21.27 C2.2 | D9.C 87,92.08 86.36,92.08 85.72,91.44 85.72,88.9 97.79,88.9 C23.2 97.79,88.27 98.42,87.63 104.14,87.63 106.05,89.53 | 85.72,100.33 85.72,97.16 78.11,97.16 IC3.7 | 85.72,100.33 85.72,102.87 86.36,103.5 87,103.5 D8.C | 85.72,100.33 96.52,100.33 | 96.52,100.33 97.79,100.33 C21.2 | 96.52,100.33 103.5,93.34 C22.2 103.5,92.71 106.05,92.71 106.05,89.53 | C18.2 103.5,113.03 v100.33,116.2 97.79,118.75 C15.2 97.79,119.38 85.72,119.38 | 85.72,119.38 85.72,115.57 81.92,115.57 | 85.72,119.38 85.72,121.92 86.36,122.56 87,122.56 D6.C | 79.38,115.57 78.11,115.57 IC4.7 | 79.38,115.57 80.01,115.57 | 80.01,115.57 81.92,115.57 | 80.01,115.57 75.56,111.12 74.3,111.12 C17.2 | 81.92,115.57 R29.1 | 79.38,115.57 79.38,120.65 81.28,122.56 81.92,122.56 R18.1 | 107.31,123.83 103.5,123.83 C13.2 | 107.31,123.83 107.95,123.83 109.86,125.73 114.3,125.73 C14.2 114.3,146.05 LED_ARRAY.4 | 107.31,123.83 108.58,122.56 IC1.5 | D7.C 87,111.76 86.36,111.76 v85.72,111.12 85.72,108.58 97.79,108.58 C19.2 | 15.88,4.45 15.88,1.91 R139.2 | 15.88,9.53 15.88,6.99 | 15.88,6.99 15.88,4.45 | 15.88,4.45 R132.2 | 15.88,6.99 R131.2 | 81.28,69.22 80.01,69.22 NEBULA_A.17 | 81.28,69.22 82.55,69.22 NEBULA_A.15 v82.55,71.12 | 81.28,69.22 NEBULA_A.16 | C6.2 36.83,31.11 34.29,31.11 C35.2 34.29,30.48 30.48,30.48 27.3,27.3 IC22.1 | JP2.3 100.97,13.97 95.89,8.89 C1.2 | 24.13,26.65 C36.2 | 48.69,16.72 46.35,19.05 C37.2 | C3.2 72.39,42.55 76.2,42.55 C8.2 76.2,54.61 78.11,54.61 78.11,58.42 77.47,59.05 NEBULA_A.10
  Top 0.508: v80.64,92.71 81.92,92.71 R43.1 | v80.64,104.14 81.92,104.14 R36.1 | C12.2 17.78,26.65 | C11.2 20.95,26.65 | C20.2 103.5,104.14 109.86,104.14 STAR_INPUT.1 | v78.11,74.93 76.2,74.93 ULN1.9 | v65.41,109.86 65.41,109.64 | 15.88,17.17 15.88,9.53 | 15.88,9.53 R130.2 | P1.1 109.86,52.07 108.58,52.07 IC8.5 108.58,60.96 109.22,61.59 111.12,61.59 113.03,63.5 114.3,63.5 C33.2 114.3,84.45 110.49,88.27 107.31,88.27 106.05,89.53
  Top 1.27: C89.- 36.83,7.74 34.67,9.9 34.67,11.69 35.94,12.95 44.92,12.95 48.69,16.72 IC9.1 49.8,17.83 49.8,18.54 52.17,20.91 56.15,20.91 C34.2 | C2.2 34.03,20.91 29.94,20.91 27.57,18.54 27.57,17.83 IC2.1 | C9.2 20.95,17.17 | C10.2 17.78,17.17 | U$1.2 71.98,41.92 C3.2 | C32.2 108.37,146.05 LED_ARRAY.4 | R52.1 v38.1,40.64
  Top 1.905: POWER_IN.3 17.78,26.65 20.95,26.65 24.13,26.65 26.86,26.65 IC22.1 | POWER_IN.1 8.28,17.17 15.88,17.17 17.78,17.17 20.95,17.17 24.13,17.17 IC2.1
  pour $GND: 88.9,164.47 117.47,164.47 117.47,-0.64 -0.64,-0.64 -0.64,35.56 36.83,35.56 36.83,78.74 50.16,78.74 50.16,103.5 65.41,103.5 65.41,131.44 88.9,131.44
GND2
  Top 1.905: D11.1 48.26,153.03 49.72,153.03 49.79,153.11 51.81,153.11 51.88,153.03 53.34,153.03 D11.3 70.03,150.68 C29.- 76.83,151.76 78.74,149.86 78.74,139.06 76.83,137.16 55.88,137.16 38.1,119.38 38.1,74.93 | Q3.3 37.2,54.98 38.1,55.88 38.1,65.41 | 38.1,74.93 38.1,65.41 | Q2.3 37.84,65.14 38.1,65.41 | Q1.3 37.84,74.67 38.1,74.93
GND3
  Top 0.305: 47.62,50.8 45.09,50.8 C24.2 | R54.1 C27.2 56.52,50.8 | 56.52,50.8 53.98,50.8 | 53.98,50.8 47.62,50.8 | 47.62,50.8 C25.2 | 53.98,50.8 C26.2 | R59.1 C31.2 48.26,73.66 | 48.26,73.66 45.72,73.66 C30.2 | 44.45,55.88 48.9,55.88 48.9,53.98 48.26,53.34 47.62,53.34 R51.1 | 44.45,55.88 40.01,51.44 40.01,45.72 38.73,45.72 R52.2 38.1,44.45 38.73,44.45 41.27,41.91 54.61,41.91 54.61,45.09 56.52,46.99 57.78,46.99 57.78,50.16 57.15,50.8 56.52,50.8 | 48.26,73.66 48.9,73.66 49.53,73.03 49.53,69.85 47.62,69.85 45.72,67.94 45.72,64.14 43.18,64.14 42.55,63.5 42.55,55.88 44.45,55.88
  Top 1.905: Q4.3 34.3,45.24 R52.2
LOCAL_EN  (via drill 0.35)
  Top 0.305: R37.1 75.56,107.95 71.75,107.95 R44.1 71.75,107.31 67.31,107.31 | IC4.4 74.3,116.84 62.23,116.84 60.96,115.57 55.24,115.57 51.44,111.76 51.44,107.31 67.31,107.31 | v92.71,20.32 95.25,20.32 95.25,19.05 R49.1 | v76.83,91.44 75.56,91.44 R30.1 75.56,92.08 71.75,92.08 R21.1 | v67.31,100.97 67.31,107.31
  SIGNAL3 0.305: v76.83,91.44 v67.31,100.97
  Bottom 0.305: v92.71,20.32 75.56,20.32 75.56,72.39 76.83,73.66 v76.83,91.44
N$1
  Top 1.27: U$1.16 93.75,8.9 C1.1
N$2
  Top 0.508: U1.4 59.93,125.33 61.17,126.58 R2.1
N$3
  Top 0.305: R4.1 D2.A
N$4
  Top 0.508: R3.1 D3.A
N$5  (via drill 0.35)
  Top 0.305: P1.2 114.3,53.98 R5.2 | v111.12,57.78 IC8.7
  Bottom 0.305: v111.12,57.78 111.12,55.24 P1.2
N$6
  Top 0.305: 109.86,56.52 114.3,56.52 R5.1 | 109.86,56.52 IC8.6 | 109.86,56.52 P1.3
N$7
  Top 1.27: R13.1 33.5,135.89 32.38,135.89 30.48,133.99 30.48,123.83 29.82,123.17 X3.3
N$8
  Top 1.27: R13.2 33.66,133.35 36.83,133.35 R12.1
N$9
  Top 1.27: R12.2 36.83,136.53 40.01,136.53 R11.1
N$10
  Top 1.27: R11.2 40.01,133.35 43.18,133.35 R10.1
N$11  (via drill 0.35)
  Top 1.27: v45.72,135.25 43.81,135.25 43.18,135.89 R10.2 | v51.44,118.75 51.44,116.84 U1.1
  Bottom 1.27: v45.72,135.25 51.44,129.54 v51.44,118.75
N$12
  Top 0.305: D1.C 57.78,109.86 59.05,111.12 60.33,111.12 R7.1
N$13
  Top 3.81: X3.2 9.55,118.09 K2.NO
N$14
  Bottom 3.81: K1.C 12.72,128.25 X3.4
N$15  (via drill 0.35)
  Top 1.27: v48.9,115.57 50.16,114.3 U1.2
  Top 3.81: X3.1 27.94,92.03 K2.C
  Bottom 1.27: v48.9,115.57 37.47,127 37.47,129.54 36.2,130.81 31.11,130.81 31.11,87.63 K2.C
N$16
  Top 0.305: R17.2 84.45,123.19 85.09,123.83 88.9,123.83 89.53,123.19 R16.2 89.53,122.56 91.44,122.56 92.08,121.92 T1.3
N$17
  Top 0.305: 100.33,121.28 97.79,121.28 | 100.33,121.28 R14.1 | 100.33,121.28 R9.2 | 97.79,121.28 94.61,121.28 T1.1 | 97.79,121.28 C15.1
N$18
  Top 0.305: D6.A 87,121.28 89.53,121.28 R16.1
N$19  (via drill 0.35)
  Top 0.305: R17.1 84.45,121.28 81.92,121.28 R18.2 81.92,120.65 v80.64,119.38 | v72.39,99.69 70.48,97.79 IC3.1
  Bottom 0.305: v80.64,119.38 72.39,111.12 v72.39,99.69
N$20
  Top 0.305: R15.1 97.79,123.19 94.61,123.19 T1.2
N$21
  Top 0.305: IC4.2 R20.1
N$22
  Top 0.305: R20.2 71.75,111.12 72.39,111.12 73.66,112.39 74.3,112.39 C17.1 74.3,113.03 | IC4.3 73.03,113.03 74.3,113.03 | IC4.5 75.56,113.67 74.93,113.67 74.3,113.03
N$23
  Top 0.305: 69.22,113.03 66.67,113.03 C16.1 | 69.22,113.03 69.22,114.94 70.48,114.94 IC4.1 | 69.22,113.03 R19.2
N$24
  Top 0.305: IC3.2 R21.2
N$25
  Top 0.305: 100.33,110.49 97.79,110.49 | 100.33,110.49 R23.1 | 100.33,110.49 R22.2 | 97.79,110.49 94.61,110.49 T2.1 | 97.79,110.49 C19.1
N$26
  Top 0.305: R28.2 84.45,112.39 85.09,113.03 88.9,113.03 89.53,112.39 R25.2 89.53,111.76 91.44,111.76 92.08,111.12 T2.3
N$27
  Top 0.305: D7.A 87,110.49 89.53,110.49 R25.1
N$28  (via drill 0.35)
  Top 0.305: R28.1 84.45,110.49 81.92,110.49 R29.2 v81.92,108.58 | v76.83,99.06 76.2,98.42 74.93,98.42 74.3,97.79 IC3.4
  Bottom 0.305: v81.92,108.58 76.83,103.5 v76.83,99.06
N$29
  Top 0.305: R24.1 97.79,112.39 94.61,112.39 T2.2
N$30
  Top 0.305: IC3.5 R30.2
N$31
  Top 0.305: 100.33,102.23 97.79,102.23 | 100.33,102.23 R32.1 | 100.33,102.23 R31.2 | 97.79,102.23 94.61,102.23 T3.1 | 97.79,102.23 C21.1
N$32
  Top 0.305: R35.2 84.45,104.14 85.09,104.78 88.9,104.78 89.53,104.14 R34.2 89.53,103.5 91.44,103.5 92.08,102.87 T3.3
N$33
  Top 0.305: D8.A 87,102.23 89.53,102.23 R34.1
N$34
  Top 0.305: R35.1 84.45,102.23 81.92,102.23 R36.2 81.92,101.6 81.28,100.97 77.47,100.97 76.83,101.6 IC3.9
N$35
  Top 0.305: R33.1 97.79,104.14 94.61,104.14 T3.2
N$36
  Top 0.305: IC3.10 R37.2
N$37
  Top 0.305: 100.33,90.81 97.79,90.81 | 100.33,90.81 R39.1 | 100.33,90.81 R38.2 | 97.79,90.81 94.61,90.81 T4.1 | 97.79,90.81 C23.1
N$38
  Top 0.305: R42.2 84.45,92.71 85.09,93.34 88.9,93.34 89.53,92.71 R41.2 89.53,92.08 91.44,92.08 92.08,91.44 T4.3
N$39
  Top 0.305: D9.A 87,90.81 89.53,90.81 R41.1
N$40
  Top 0.305: R42.1 84.45,90.81 81.92,90.81 R43.2 81.92,90.17 71.12,90.17 69.22,92.08 69.22,100.33 71.75,100.33 73.03,101.6 IC3.12
N$41
  Top 0.305: R40.1 97.79,92.71 94.61,92.71 T4.2
N$42
  Top 0.305: IC3.13 R44.2
N$43  (via drill 0.35)
  Top 0.305: v82.55,27.94 95.25,27.94 95.25,26.67 R45.1 | v74.93,99.69 73.03,97.79 IC3.3
  Bottom 0.305: v82.55,27.94 81.28,29.21 81.28,90.81 75.56,96.52 75.56,99.06 v74.93,99.69
N$44  (via drill 0.35)
  Top 0.305: v95.25,30.48 95.25,29.21 R46.1 | v92.71,92.71 90.81,94.61 78.11,94.61 76.83,95.89 IC3.6
  Bottom 0.305: v95.25,30.48 92.71,33.02 v92.71,92.71
N$45  (via drill 0.35)
  Top 0.305: v85.09,34.29 87.63,34.29 88.9,33.02 95.25,33.02 95.25,31.75 R47.1 | v80.64,102.87 78.11,102.87 IC3.8
  Bottom 0.305: v85.09,34.29 85.09,98.42 v80.64,102.87
N$46  (via drill 0.35)
  Top 0.305: v95.25,22.86 95.25,21.59 R48.1 | v83.82,98.42 81.92,100.33 75.56,100.33 74.3,101.6 IC3.11
  Bottom 0.305: v95.25,22.86 83.82,22.86 v83.82,98.42
N$47
  Top 0.305: R61.2 15.88,64.75 | D13.A 19.05,64.75
  Top 1.905: FIRE.6 15.88,64.75 19.05,64.75 25.1,64.75 Q2.4
N$48
  Top 0.305: R53.1 53.98,55.24 56.52,55.24 R54.2 56.52,54.61 57.15,54.61 58.42,53.34 58.42,45.09 57.78,45.09 IC6.1
N$49
  Top 0.305: 15.88,74.91 R60.2 | D12.A 19.05,74.91
  Top 1.905: FIRE.8 15.88,74.91 19.05,74.91 24.47,74.91 Q1.4
N$50
  Top 0.305: R51.2 47.62,55.24 45.09,55.24 R50.1 45.09,54.61 44.45,54.61 41.91,52.07 41.91,42.55 46.35,42.55 48.26,44.45 IC5.1
N$51
  Top 0.305: R62.2 15.88,54.59 | D14.A 19.05,54.59
  Top 1.905: FIRE.4 15.88,54.59 19.05,54.59 25.1,54.59 Q3.4
N$52
  Top 0.305: R63.2 15.88,44.43 15.88,44.45 | D15.A 19.05,44.43
  Top 1.905: FIRE.2 15.88,44.43 19.05,44.43 25.1,44.43 Q4.4
N$53
  Top 0.305: R58.1 45.72,78.11 48.26,78.11 R59.2 48.26,77.47 48.9,77.47 50.16,76.2 50.16,67.94 48.9,67.94 IC7.1
N$54
  Top 0.305: R63.1 15.88,41.27 16.51,40.64 22.23,40.64 D16.C
N$55
  Top 0.305: R62.1 20.88,51.76 D17.C
N$56
  Top 0.305: R61.1 20.88,61.91 D18.C
N$57
  Top 0.305: R60.1 20.88,71.44 D19.C
N$108  (via drill 0.35)
  Top 0.305: R1.2 114.3,116.2 109.86,116.2 STAR_INPUT.7 | v111.12,120.02 IC1.7
  Bottom 0.305: v111.12,120.02 111.12,117.47 109.86,116.2 STAR_INPUT.7
N$109
  Top 0.305: 109.86,118.75 114.3,118.75 R1.1 | 109.86,118.75 IC1.6 | 109.86,118.75 STAR_INPUT.8
N$156
  Top 0.305: R130.1 D91.C
N$157
  Top 0.305: R131.1 D92.C
N$158
  Top 0.305: R132.1 D93.C
N$159
  Top 0.305: R139.1 D94.C
POOFER
  Top 0.305: 102.87,119.38 100.33,119.38 R9.1 | 102.87,119.38 103.5,120.02 C13.1 | 102.87,119.38 109.86,112.39 STAR_INPUT.5
STAR_ENABLE  (via drill 0.35)
  Top 0.305: v99.06,107.31 81.92,107.31 80.64,108.58 71.12,108.58 69.22,110.49 R19.1
  Bottom 0.305: v99.06,107.31 108.58,107.31 108.58,112.39 109.86,113.67 STAR_INPUT.6

## Text on the board
tPlace: +3v | GND 5v GND 12v | 3v / 5v / 12v / Enable
tNames: **Warning** / High Voltage | NOVA: STARBASE v01 | GND | GND | 120vac IN | +5 | **Warning** / High Voltage | FOG POWER | **Warning** / High Voltage | FOG / NEUTRAL / LINE / STATUS / ACTIVATE / COMMON | ACTIVATE | **Warning** / High Voltage | NOVA: STARBASE v01 / (c) Jm Casler 2023 / www.casler.org / www.oontz.com | Poofer | Fuel | Blower | Igniter | GND
tValues: GND / 12 TDI / 13 TCK / 14 TMS / 15 TDO